# Altium schematic sheet Power.SchDoc
size A4
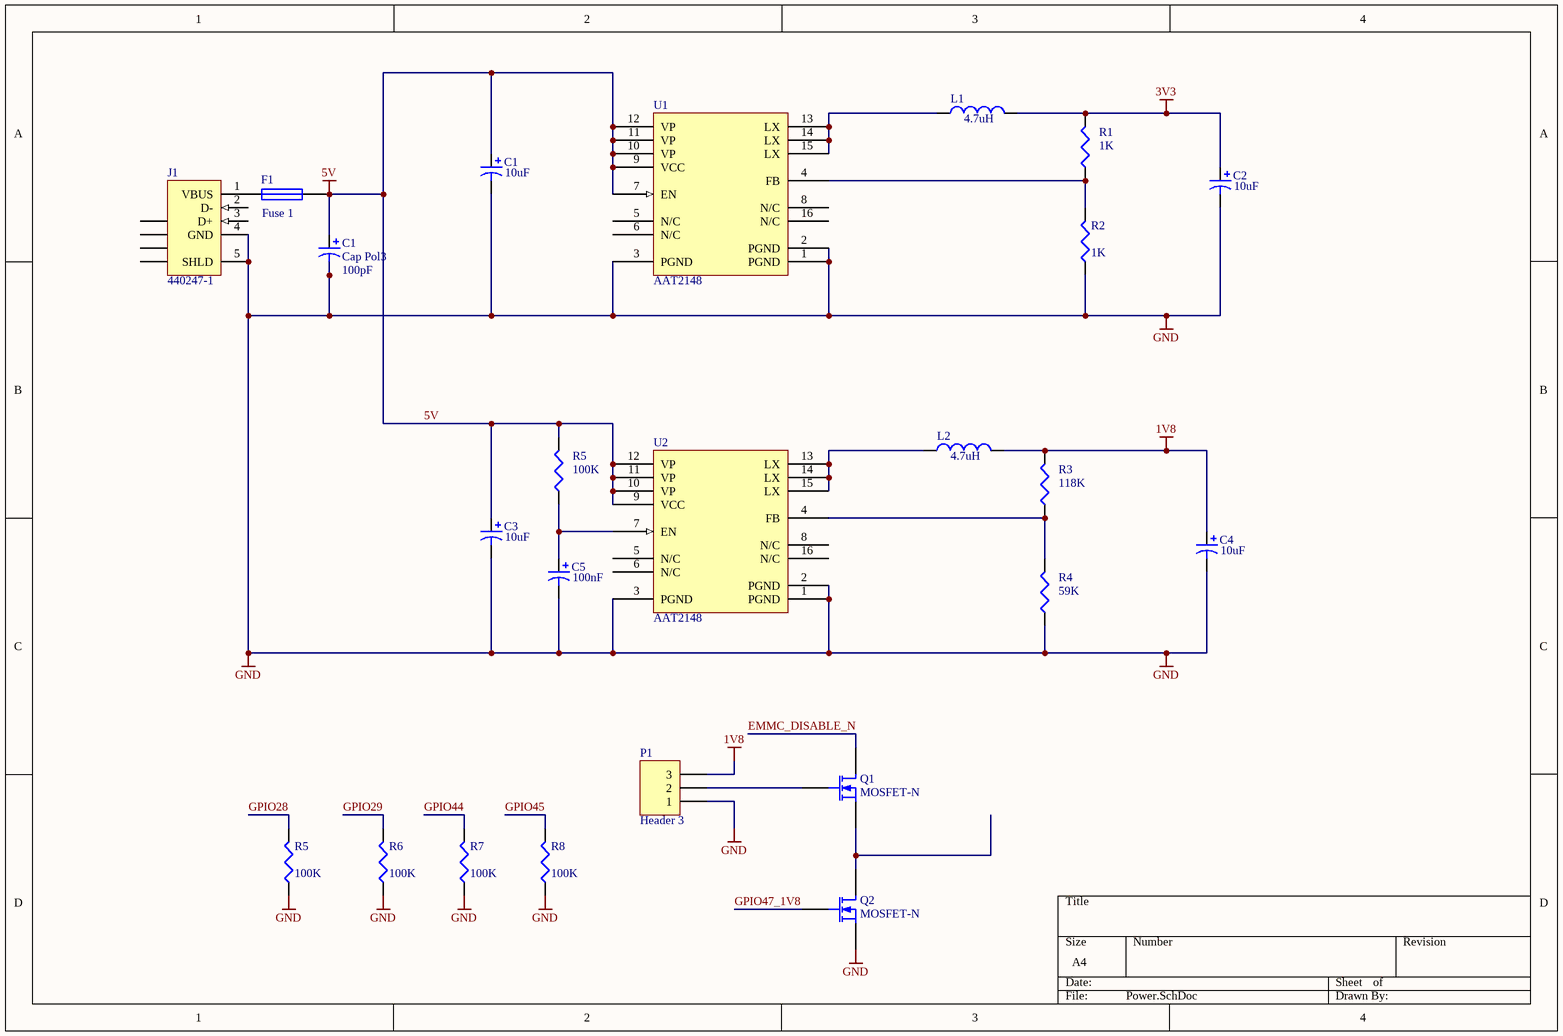
[diagram p0: Power.SchDoc]

## Parts
(Parts that share a designator on the sheet are numbered #1, #2 ... from top to bottom, then left to right.)
C1#1  value 10uF  [C0805]  (hidden comment: Cap Pol3)
C1#2  Cap Pol3  value 100pF  [C0805]
C2  value 10uF  [C0805]  (hidden comment: Cap Pol3)
C3  value 10uF  [C0805]  (hidden comment: Cap Pol3)
C4  value 10uF  [C0805]  (hidden comment: Cap Pol3)
C5  value 100nF  [C0805]  (hidden comment: Cap Pol3)
F1  Fuse 1  [PIN-W2/E2.8]
J1  440247-1  [440247]
L1  value 4.7uH  [0402-A]  (hidden comment: Inductor)
L2  value 4.7uH  [0402-A]  (hidden comment: Inductor)
P1  Header 3  [HDR1X3]
Q1  MOSFET-N  [RT-3]
Q2  MOSFET-N  [RT-3]
R1  value 1K  [J1-0603]  (hidden comment: Res3)
R2  value 1K  [J1-0603]  (hidden comment: Res3)
R3  value 118K  [J1-0603]  (hidden comment: Res3)
R4  value 59K  [J1-0603]  (hidden comment: Res3)
R5#1  value 100K  [J1-0603]  (hidden comment: Res3)
R5#2  value 100K  [J1-0603]  (hidden comment: Res3)
R6  value 100K  [J1-0603]  (hidden comment: Res3)
R7  value 100K  [J1-0603]  (hidden comment: Res3)
R8  value 100K  [J1-0603]  (hidden comment: Res3)
U1  AAT2148  [RGV16_M]
U2  AAT2148  [RGV16_M]

## Nets
1V8: C4.1 L2.2 P1.3 R3.2
3V3: C2.1 L1.2 R1.2
5V: C1#1.1 C1#2.1 C3.1 F1.2 R5#1.2 U1.7(EN) U1.9(VCC) U1.10(VP) U1.11(VP) U1.12(VP) U2.9(VCC) U2.10(VP) U2.11(VP) U2.12(VP)
GND: C1#1.2 C1#2.2 C2.2 C3.2 C4.2 C5.2 J1.4(GND) J1.5(SHLD) P1.1 Q2.3(S) R2.1 R4.1 R5#2.1 R6.1 R7.1 R8.1 U1.1(PGND) U1.2(PGND) U1.3(PGND) U2.1(PGND) U2.2(PGND) U2.3(PGND)
EMMC_DISABLE_N: Q1.1(D)
GPIO28: R5#2.2
GPIO29: R6.2
GPIO44: R7.2
GPIO45: R8.2
GPIO47_1V8: Q2.2(G)
NetC5_1: C5.1 R5#1.1 U2.7(EN)
NetL1_1: L1.1 U1.13(LX) U1.14(LX) U1.15(LX)
NetL2_1: L2.1 U2.13(LX) U2.14(LX) U2.15(LX)
NetP1_2: P1.2 Q1.2(G)
NetQ1_3: Q1.3(S) Q2.1(D)
NetR1_1: R1.1 R2.2 U1.4(FB)
NetR3_1: R3.1 R4.2 U2.4(FB)

Not connected (* = marked no-connect by the designer): F1 1; J1 1(VBUS) 2(D-) 3(D+) 6(SHLD) 7(SHLD) 8(SHLD) 9(SHLD); U1 5(N/C) 6(N/C) 8(N/C) 16(N/C); U2 5(N/C) 6(N/C) 8(N/C) 16(N/C)

## Library data of the parts
C1#1 C1#2 C2-C5 = Cap Pol3: Polarized Capacitor (Surface Mount); Published: 8-Jun-2000; LatestRevisionDate: 29-May-2009; LatestRevisionNote: IPC-7351 Footprint Added.; PackageReference: C0805; Publisher: Altium Limited; PackageDescription: Chip Capacitor
F1 = Fuse 1: Fuse; Published: 8-Jun-2000; LatestRevisionDate: 17-Jul-2002; LatestRevisionNote: Re-released for DXP Platform.; PackageReference: PIN-W2/E2.8; Publisher: Altium Limited; PackageDescription: Thru-Hole; 2 Leads
J1 = 440247-1: USB 2.0, Right Angle, SMT, B Type, Receptacle, 5 Position, Black; ContactMaterial: Copper Alloy; ContactPlating: Gold (30); PCB_Layout: Complies with manufacturer's recommendation.; DrillSize: Corresponds to nominal value.; PanelGround: Without; Published: 15-Jul-2004; DatasheetDocument: 27-Jun-2003; PackageDocument: 27-Jun-2003; PackageReference: 440247; Publisher: Altium Limited; HousingMaterial: Thermoplastic; ComponentLink1Description: Manufacturer Link; ComponentLink1URL: http://www.tycoelectronics.com/; ComponentLink2Description: Packaging Specification; ComponentLink2URL: http://ecommas.tycoelectronics.com/commerce/DocumentDelivery/DDEController?Action=showdoc&DocId=Customer+Drawing%7F440247%7FD%7Fpdf%7FEnglish%7FC_440247_D.pdf
L1 L2 = Inductor: Code_IEC: 1005; Published: 8-Jun-2000; LatestRevisionDate: 29-May-2009; LatestRevisionNote: IPC-7351 Footprint Added.; PackageReference: 0402-A; Publisher: Altium Limited; PackageDescription: Chip Inductor; Code_JEITA: 0402
P1 = Header 3: Header, 3-Pin; LatestRevisionDate: 17-Jul-2002; LatestRevisionNote: Re-released for DXP Platform.; Publisher: Altium Limited
Q1 Q2 = MOSFET-N: N-Channel MOSFET; Published: 8-Jun-2000; LatestRevisionDate: 17-Jul-2002; LatestRevisionNote: Re-released for DXP Platform.; PackageVersion: 1995/1996; PackageReference: E3; Publisher: Altium Limited; PackageDescription: TO, Flat Index; 3 In-Line, Axial Leads; Body Dia. 4.6mm; Lead Dia. 0.5 mm (max)
R1-R4 R5#1 R5#2 R6-R8 = Res3: Resistor; Published: 8-Jun-2000; LatestRevisionDate: 29-May-2009; LatestRevisionNote: IPC-7351 Footprint Added.; PackageReference: J1-0603; Publisher: Altium Limited; PackageDescription: Chip Resistor